# EAGLE design PCB_4 (EAGLE 9.6.2)
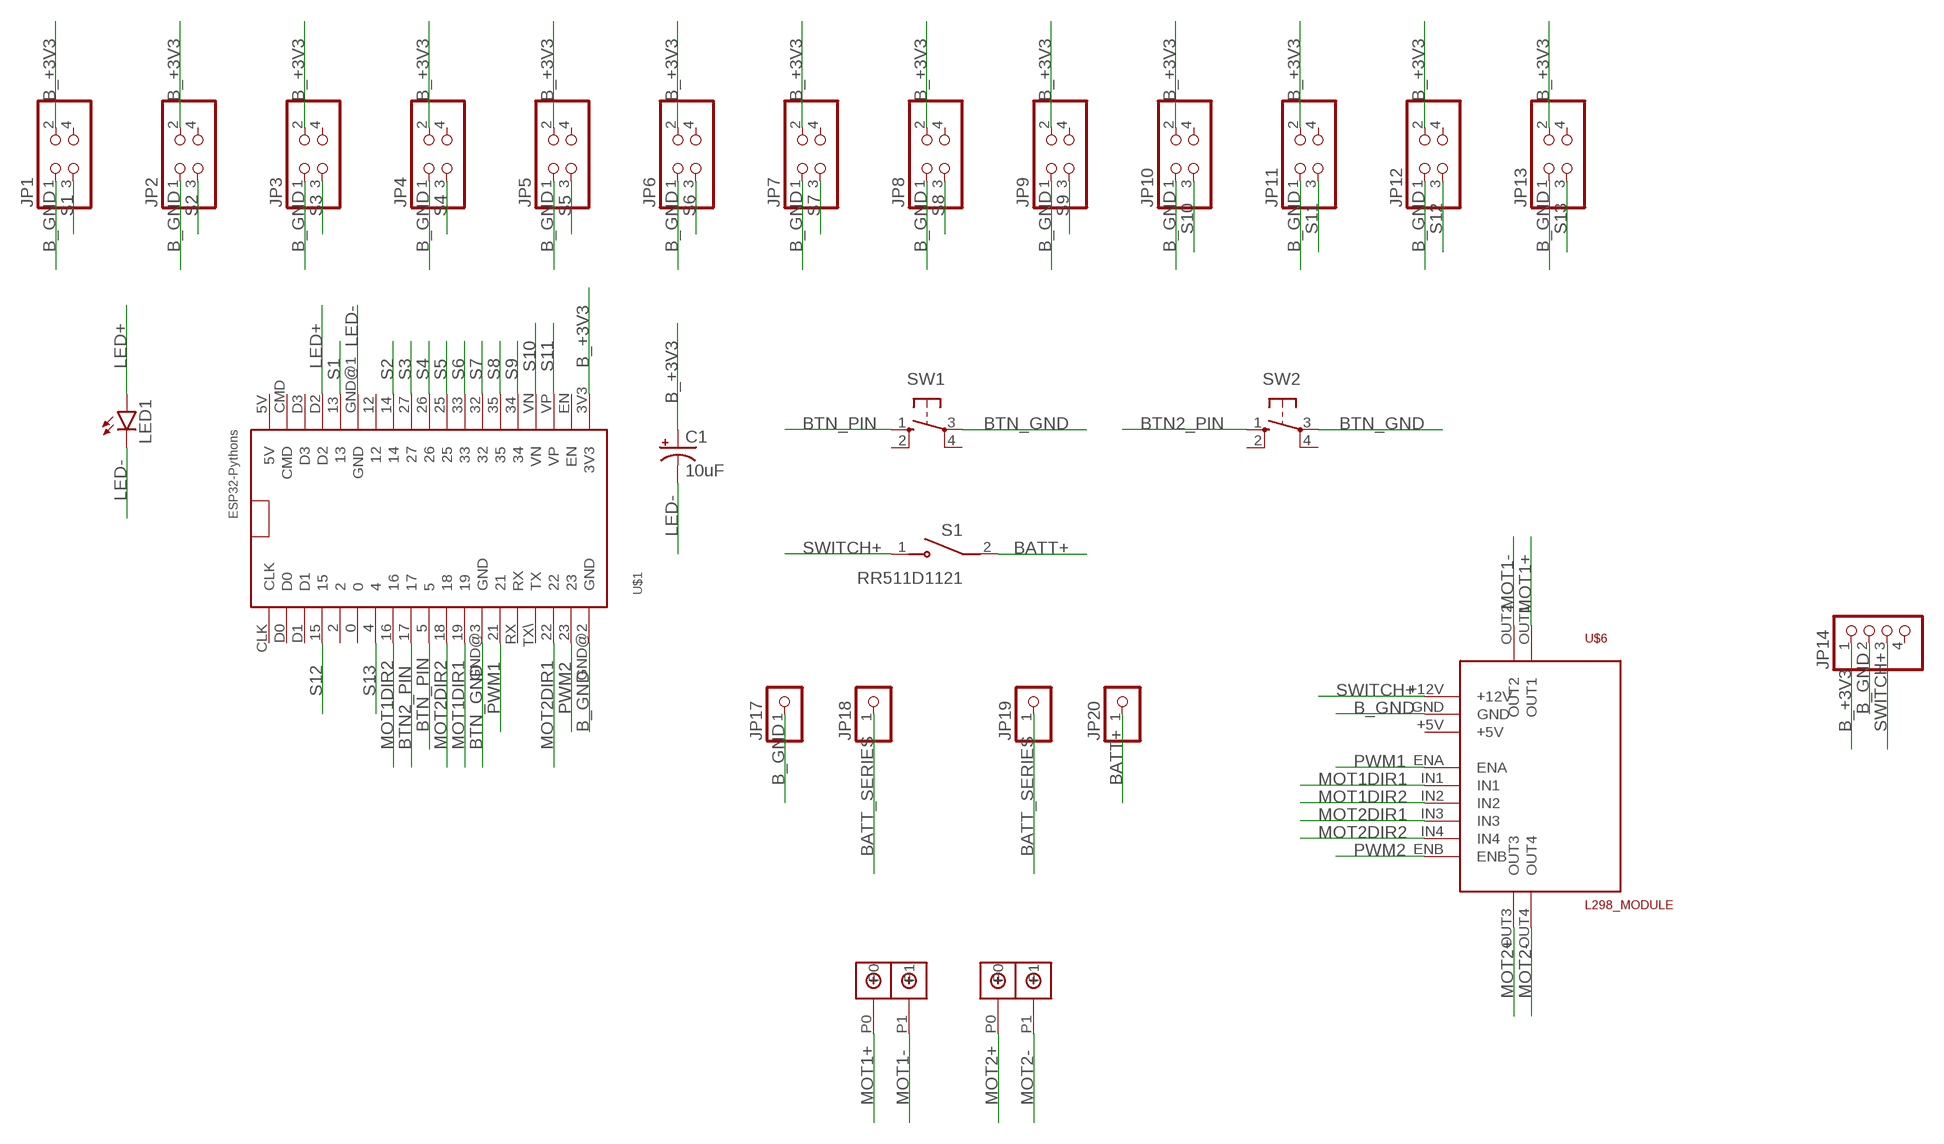
[diagram p0: schematic, sheet 1]

## Parts
C1  10uF  10UF-POLAR-RADIAL-2.5MM-25V-20%  [CPOL-RADIAL-2.5MM-5MM]
JP1  PINHD-2X2  [2X02]
JP2  PINHD-2X2  [2X02]
JP3  PINHD-2X2  [2X02]
JP4  PINHD-2X2  [2X02]
JP5  PINHD-2X2  [2X02]
JP6  PINHD-2X2  [2X02]
JP7  PINHD-2X2  [2X02]
JP8  PINHD-2X2  [2X02]
JP9  PINHD-2X2  [2X02]
JP10  PINHD-2X2  [2X02]
JP11  PINHD-2X2  [2X02]
JP12  PINHD-2X2  [2X02]
JP13  PINHD-2X2  [2X02]
JP14  PINHD-1X4  [1X04]
JP17  PINHD-1X1  [1X01]
JP18  PINHD-1X1  [1X01]
JP19  PINHD-1X1  [1X01]
JP20  PINHD-1X1  [1X01]
LED1  LED5MM  [LED5MM]
S1  RR511D1121  [E-SWITCH_RR511D1121]
SW1  10-XX  [B3F-10XX]
SW2  10-XX  [B3F-10XX]
U$1  ESP32DEVKITV1  [ESP32-DEVKITV1]
U$2  DBCONN-1X2  [DBCONN-1X2]
U$3  DBCONN-1X2  [DBCONN-1X2]
U$6  L298_MODULE  [L298_MODULE]

## Nets
B_+3V3: C1.1(+) JP1.2 JP2.2 JP3.2 JP4.2 JP5.2 JP6.2 JP7.2 JP8.2 JP9.2 JP10.2 JP11.2 JP12.2 JP13.2 JP14.1 U$1.3V3
B_GND: JP1.1 JP2.1 JP3.1 JP4.1 JP5.1 JP6.1 JP7.1 JP8.1 JP9.1 JP10.1 JP11.1 JP12.1 JP13.1 JP14.2 JP17.1 U$1.GND@2(GND) U$6.GND
BATT+: JP20.1 S1.2(COM)
BATT_SERIES: JP18.1 JP19.1
BTN2_PIN: SW2.1(S) U$1.17
BTN_GND: SW1.3(P) SW2.3(P) U$1.GND@3(GND)
BTN_PIN: SW1.1(S) U$1.5
LED+: LED1.A U$1.D2
LED-: C1.2(-) LED1.K(C) U$1.GND@1(GND)
MOT1+: U$2.P0 U$6.OUT1
MOT1-: U$2.P1 U$6.OUT2
MOT1DIR1: U$1.19 U$6.IN1
MOT1DIR2: U$1.16 U$6.IN2
MOT2+: U$3.P0 U$6.OUT3
MOT2-: U$3.P1 U$6.OUT4
MOT2DIR1: U$1.22 U$6.IN3
MOT2DIR2: U$1.18 U$6.IN4
PWM1: U$1.21 U$6.ENA
PWM2: U$1.23 U$6.ENB
S1: JP1.3 U$1.13
S2: JP2.3 U$1.14
S3: JP3.3 U$1.27
S4: JP4.3 U$1.26
S5: JP5.3 U$1.25
S6: JP6.3 U$1.33
S7: JP7.3 U$1.32
S8: JP8.3 U$1.35
S9: JP9.3 U$1.34
S10: JP10.3 U$1.VN
S11: JP11.3 U$1.VP
S12: JP12.3 U$1.15
S13: JP13.3 U$1.4
SWITCH+: JP14.3 S1.1(NO) U$6.+12V
Unconnected: JP1.4 JP2.4 JP3.4 JP4.4 JP5.4 JP6.4 JP7.4 JP8.4 JP9.4 JP10.4 JP11.4 JP12.4 JP13.4 JP14.4 SW1.2(S1) SW1.4(P1) SW2.2(S1) SW2.4(P1) U$1.0 U$1.2 U$1.5V U$1.12 U$1.CLK U$1.CMD U$1.D0 U$1.D1 U$1.D3 U$1.EN U$1.RX U$1.TX\(TX) U$6.+5V

## Library data of the parts
C1 = SparkFun-Capacitors:10UF-POLAR: 10.0µF polarized capacitors A capacitor is a passive two-terminal electrical component used to store electrical energy temporarily in an electric field.; PROD_ID: CAP-08440
JP1-JP13 = pinhead:PINHD-2X2: PIN HEADER
JP14 = pinhead:PINHD-1X4: PIN HEADER
JP17-JP20 = pinhead:PINHD-1X1: PIN HEADER
LED1 = led:LED: LED OSRAM: - CHIPLED LG R971, LG N971, LY N971, LG Q971, LY Q971, LO R971, LY R971 LH N974, LH R974 LS Q976, LO Q976, LY Q976 LO Q996 - Hyper CHIPLED LW Q18S LB Q993, LB Q99A, LB R99A - SideLED LS A670, LO A670, LY A670, LG A670, LP A670 LB A673, LV A673, LT A673, LW A673 LH A674 LY A675 LS A676, LA A676, LO A676, LY A676, LW A676 LS A679, LY A679, LG A679 - Hyper Micro SIDELED® LS Y876, LA Y876, LO Y876, LY Y876 LT Y87S - SmartLED LW L88C, LW L88S LB L89C, LB L89S, LG L890 LS L89K, LO L89K, LY L89K LS L896, LA L896, LO L896, LY L896 - TOPLED LS T670, LO T670, LY T670, LG T670, LP T670 LSG T670, LSP T670, LSY T670, LOP T670, LYG T670 LG T671, LOG T671, LSG T671 LB T673, LV T673, LT T673, LW T673 LH T674 LS T676, LA T676, LO T676, LY T676, LB T676, LH T676, LSB T676, LW T676 LB T67C, LV T67C, LT T67C, LS T67K, LO T67K, LY T67K, LW E67C LS E67B, LA E67B, LO E67B, LY E67B, LB E67C, LV E67C, LT E67C LW T67C LS T679, LY T679, LG T679 LS T770, LO T770, LY T770, LG T770, LP T770 LB T773, LV T773, LT T773, LW T773 LH T774 LS E675, LA E675, LY E675, LS T675 LS T776, LA T776, LO T776, LY T776, LB T776 LHGB T686 LT T68C, LB T68C - Hyper Mini TOPLED® LB M676 - Mini TOPLED Santana® LG M470 LS M47K, LO M47K, LY M47K Source: http://www.osram.convergy.de LUXEON: - LUMILED® LXK2-PW12-R00, LXK2-PW12-S00, LXK2-PW14-U00, LXK2-PW14-V00 LXK2-PM12-R00, LXK2-PM12-S00, LXK2-PM14-U00 LXK2-PE12-Q00, LXK2-PE12-R00, LXK2-PE12-S00, LXK2-PE14-T00, LXK2-PE14-U00 LXK2-PB12-K00, LXK2-PB12-L00, LXK2-PB12-M00, LXK2-PB14-N00, LXK2-PB14-P00, LXK2-PB14-Q00 LXK2-PR12-L00, LXK2-PR12-M00, LXK2-PR14-Q00, LXK2-PR14-R00 LXK2-PD12-Q00, LXK2-PD12-R00, LXK2-PD12-S00 LXK2-PH12-R00, LXK2-PH12-S00 LXK2-PL12-P00, LXK2-PL12-Q00, LXK2-PL12-R00 Source: www.luxeon.com KINGBRIGHT: KA-3528ASYC Source: www.kingbright.com
S1 = RR511D1121:RR511D1121: Check availability <https://pricing.snapeda.com/parts/RR511D1121/E-Switch/view-part?ref=eda>; AVAILABILITY: In Stock; CHECK_PRICES: https://www.snapeda.com/parts/RR511D1121/E-Switch/view-part/?ref=eda; DESCRIPTION: Rocker Switch, RR5 Series, SPST,OFF-ON,Blk Rocker,I/O Legend, 20A, 125VAC, | E-Switch RR511D1121; MF: E-Switch; MP: RR511D1121; PACKAGE: None; PRICE: None; PURCHASE-URL: https://www.snapeda.com/api/url_track_click_mouser/?unipart_id=351624&manufacturer=E-Switch&part_name=RR511D1121&search_term=None; SNAPEDA_LINK: https://www.snapeda.com/parts/RR511D1121/E-Switch/view-part/?ref=snap
SW1 SW2 = buttons:10-XX: OMRON SWITCH
U$1 = ESP32-DEVKITV1:ESP32DEVKITV1
U$2 U$3 = Terminal Block Connector:DBCONN-1X2
U$6 = L298_Module:L298_MODULE

## Board
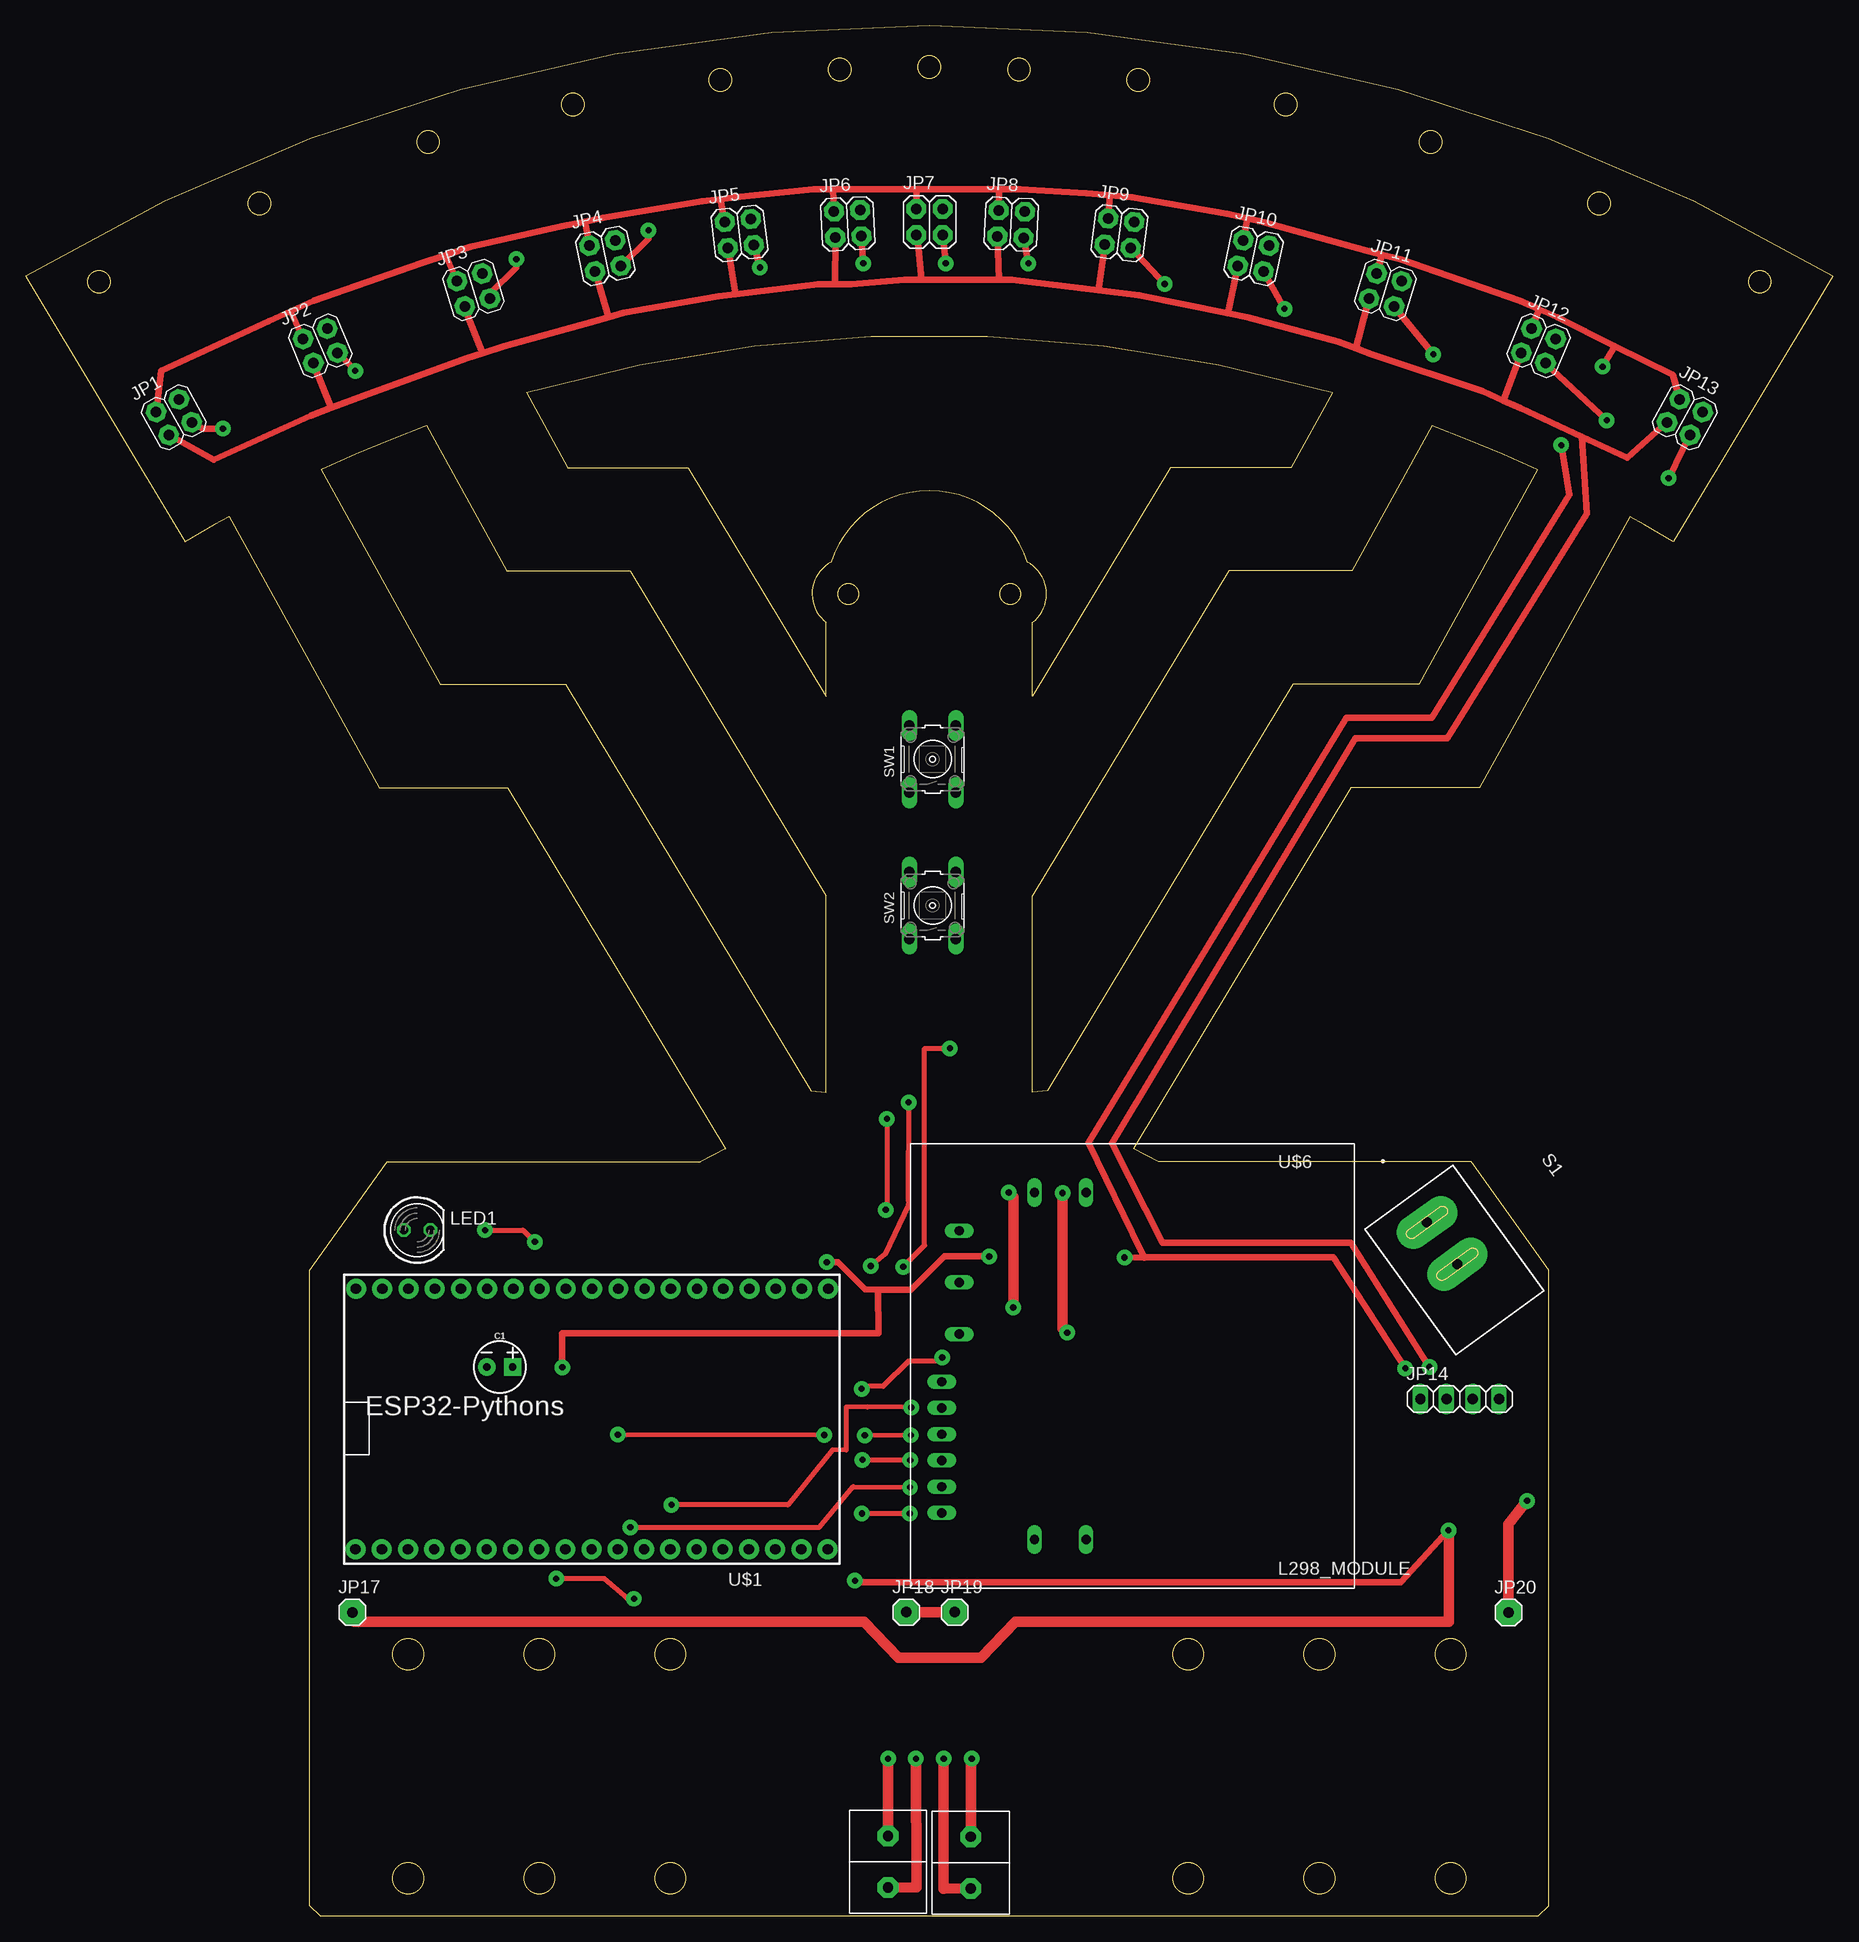
[diagram p1: board, top side]
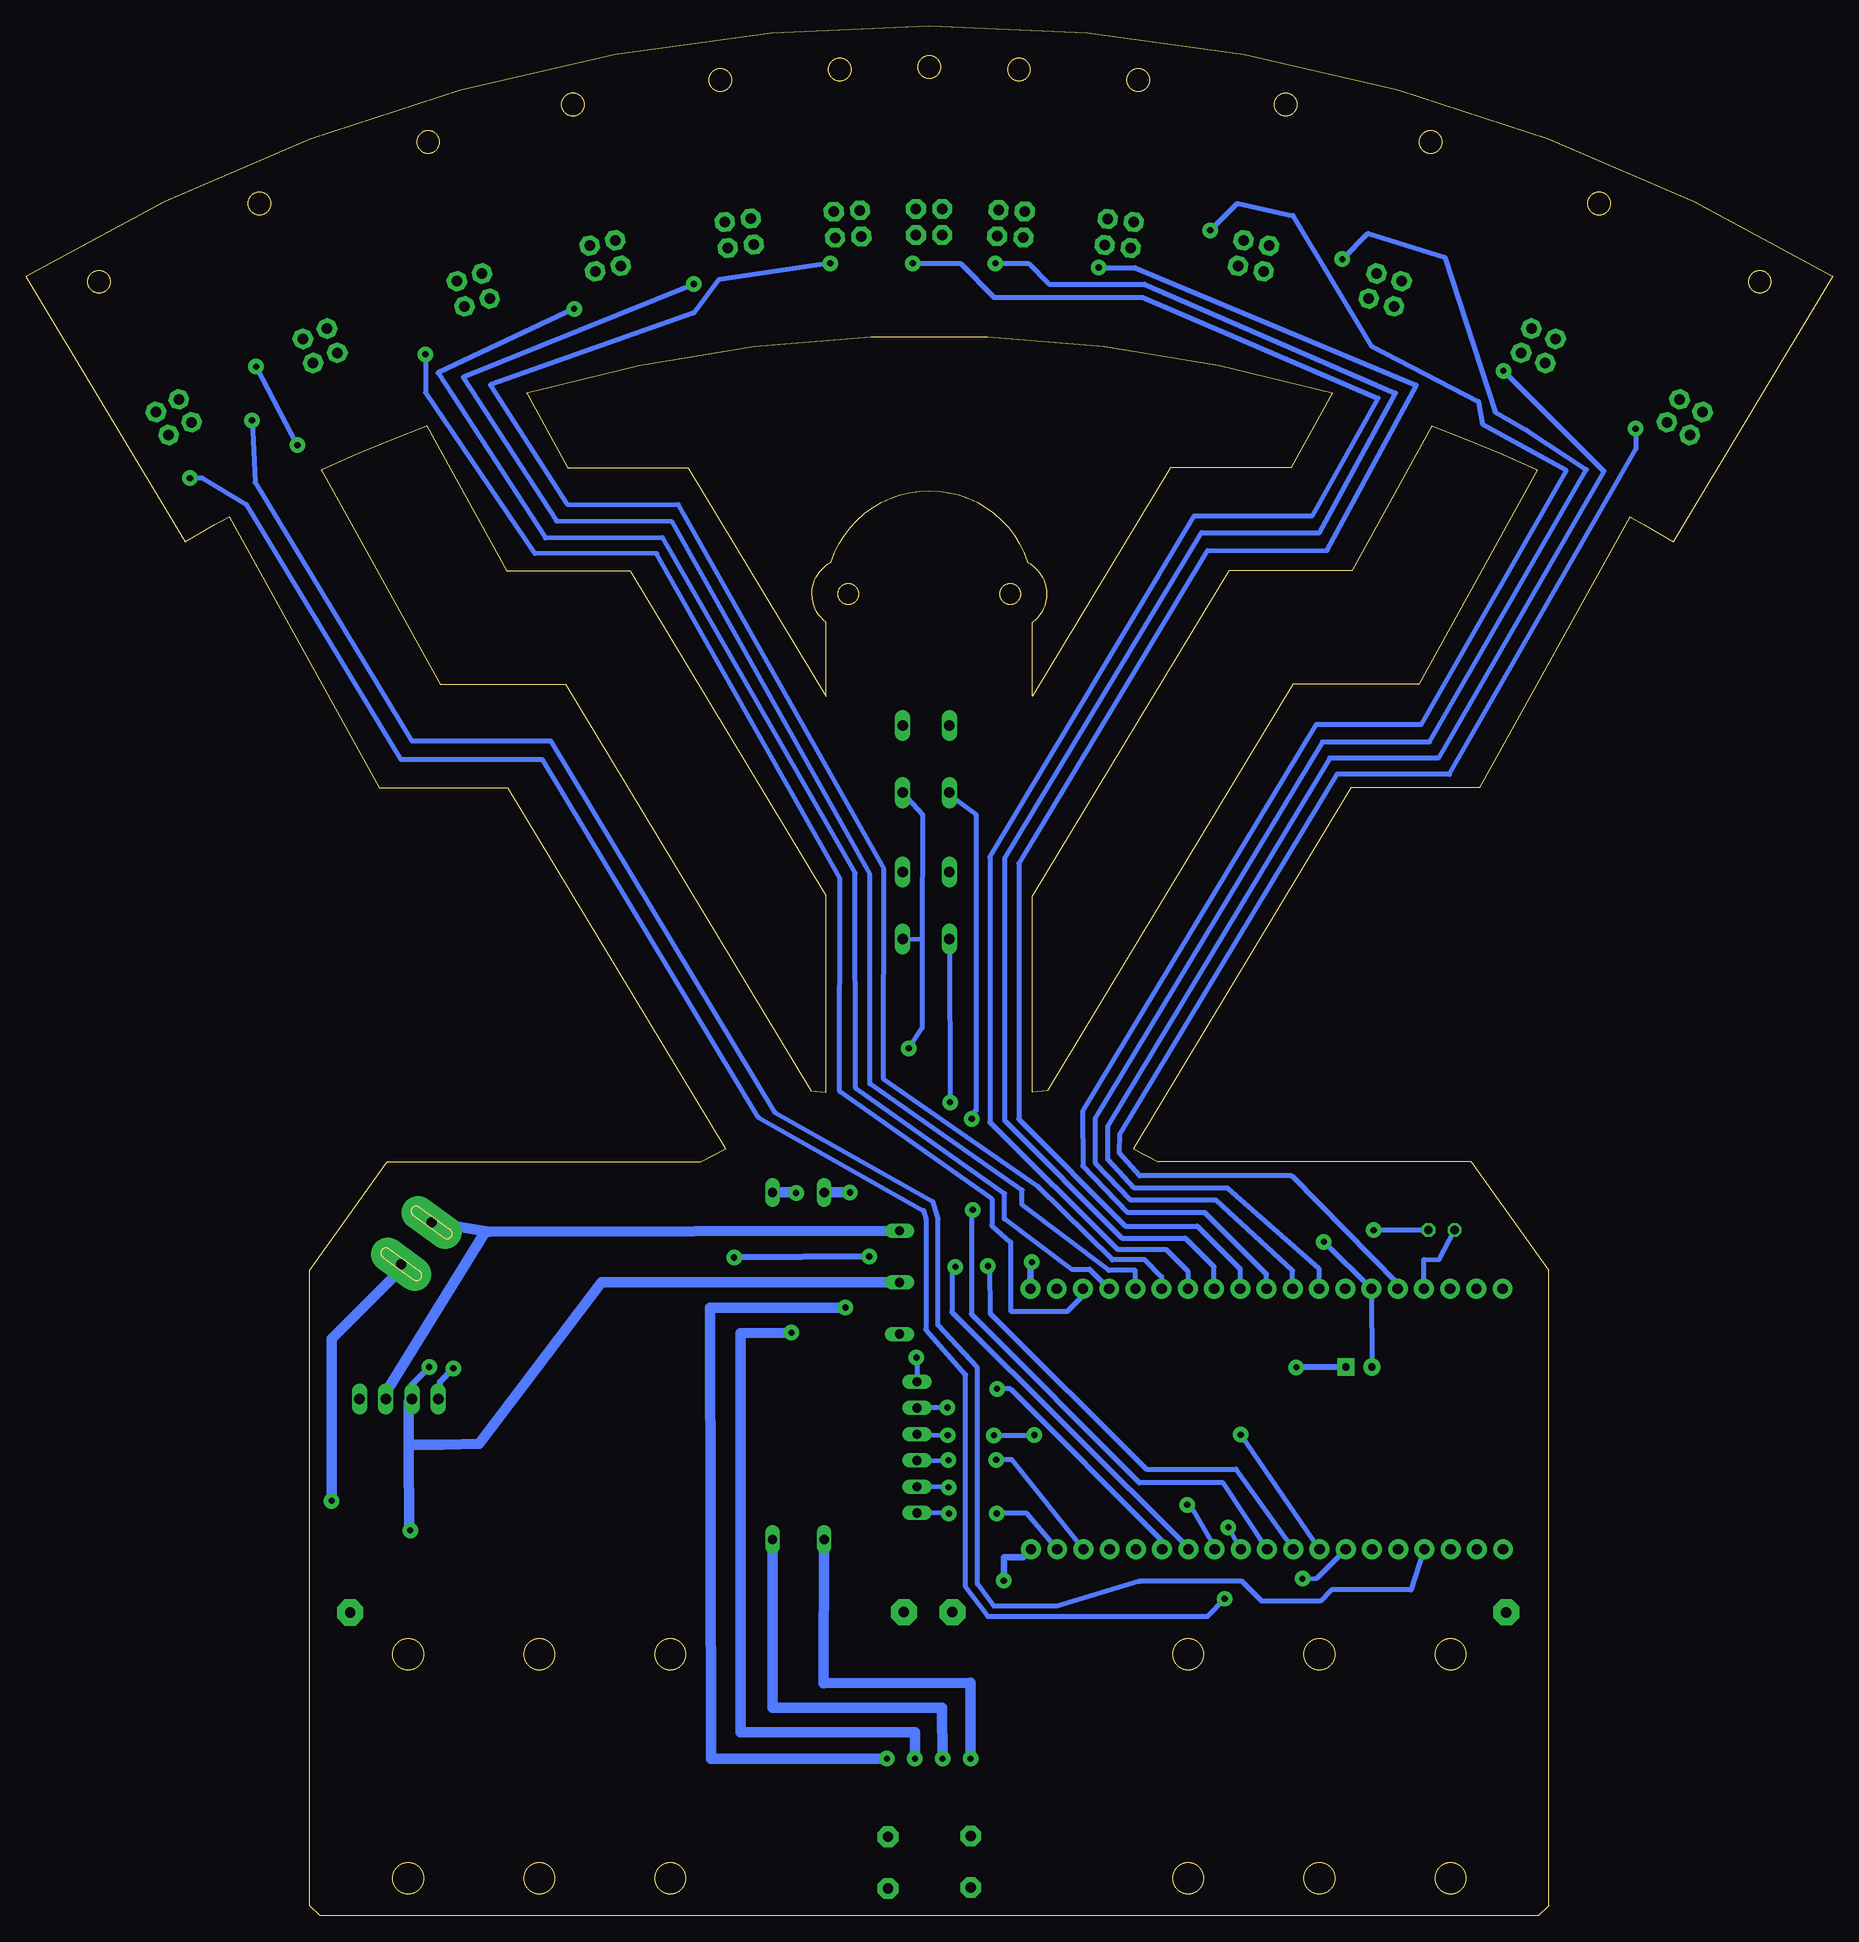
[diagram p2: board, bottom side, seen from below]

Size 175 x 183 mm. Coordinates in mm from the lower left corner, seen from the top.
Outline: 155.33,135.47 155.33,135.47
Outline: 155.33,135.47 140.79,109.23 128.35,109.23 107.25,74.28 109.67,73 140,73 147.5,62.5 147.5,1 146.5,0 28.5,0 27.5,1 27.5,62.5 35,73 65.33,73 67.75,74.28 46.65,109.23 34.21,109.23 19.67,135.47 arc2 15.44,133.03
Outline: 155.33,135.47 arc-2 159.56,133.03 175,158.75 arc62 0,158.75 15.44,133.03
Outline: 15.44,133.03 15.44,133.03
Outline: 97.5,118.11 97.5,125.24 arc114 97.01,131.08 arc144 77.99,131.08 arc114 77.5,125.24 77.5,118.11 64.15,140.23 52.48,140.23 48.48,147.45 arc-32 126.52,147.45 122.52,140.23 110.85,140.23 97.5,118.11
Outline: 28.59,140 40.1,119.23 52.3,119.23 76.04,79.89 77.5,79.76 77.5,98.76 58.51,130.23 46.58,130.23 38.81,144.26 arc5 28.59,140
Outline: 146.41,140 arc5 136.19,144.26 128.42,130.23 116.49,130.23 97.5,98.76 97.5,79.76 98.96,79.89 122.7,119.23 134.9,119.23 146.41,140
Outline: circle at 125.28,25.35 radius 1.5
Outline: circle at 137.97,25.35 radius 1.5
Outline: circle at 37.02,25.35 radius 1.5
Outline: circle at 49.73,25.35 radius 1.5
Outline: circle at 62.42,25.35 radius 1.5
Outline: circle at 112.58,25.35 radius 1.5
Outline: circle at 125.28,3.65 radius 1.5
Outline: circle at 37.02,3.65 radius 1.5
Outline: circle at 49.73,3.65 radius 1.5
Outline: circle at 62.42,3.65 radius 1.5
Outline: circle at 95.35,128 radius 1
Outline: circle at 167.92,158.22 radius 1.09
Outline: circle at 152.36,165.8 radius 1.09
Outline: circle at 136.03,171.75 radius 1.09
Outline: circle at 122.01,175.37 radius 1.09
Outline: circle at 107.73,177.76 radius 1.09
Outline: circle at 96.19,178.77 radius 1.09
Outline: circle at 87.5,179 radius 1.09
Outline: circle at 78.81,178.77 radius 1.09
Outline: circle at 67.27,177.76 radius 1.09
Copper layers (1*16): Top 0.035mm / dielectric 1.5mm / Bottom 0.035mm
Design rules "default *": minimum track width 0.5mm, minimum drill 0.35mm, track to track 0.5mm, track to pad 0.5mm, pad to pad 0.5mm, via to via 0.5mm, smd to smd 6mil, copper to edge 40mil, drill to drill 6mil, minimum pad ring 10mil, minimum via ring 8mil, stop-mask expansion 4mil, vias tented up to drill 0mil, thermal gap 10mil

### Footprints (pad centres in the part's own frame; a part is rotated, then mirrored left to right if it is on the bottom)
CPOL-RADIAL-2.5MM-5MM = drill 0.7 pad 1.651 square: 1 1.25,0 | drill 0.7 pad 1.651: 2 -1.25,0
2X02 = drill 1.016 pad 1.905 octagon: 1 -1.27,-1.27; 2 -1.27,1.27; 3 1.27,-1.27; 4 1.27,1.27
1X04 = drill 1.016 long: 1 -3.81,0; 2 -1.27,0; 3 1.27,0; 4 3.81,0
1X01 = drill 1.016 pad 2.54 octagon: 1 0,0
LED5MM = drill 0.813 octagon: A -1.27,0; K 1.27,0
E-SWITCH_RR511D1121 = drill 0.98 pad 3.26 long: 1 -5,0; 2 0,0
B3F-10XX = drill 1.016 long: 1 -3.251,2.261; 2 3.251,2.261; 3 -3.251,-2.261; 4 3.251,-2.261
ESP32-DEVKITV1 = drill 1 pad 1.93: 0 8.93,12.962; 2 11.47,12.962; 3V3 -24.14,-12.27; 4 6.39,12.962; 5 -1.23,12.962; 5V 21.58,-12.27; 12 6.34,-12.27; 13 11.42,-12.27; 14 3.8,-12.27; 15 14.01,12.962; 16 3.85,12.962; 17 1.31,12.962; 18 -3.77,12.962; 19 -6.31,12.962; 21 -11.39,12.962; 22 -19.01,12.962; 23 -21.55,12.962; 25 -3.82,-12.27; 26 -1.28,-12.27; 27 1.26,-12.27; 32 -8.9,-12.27; 33 -6.36,-12.27; 34 -13.98,-12.27; 35 -11.44,-12.27; CLK 21.63,12.962; CMD 19.04,-12.27; D0 19.09,12.962; D1 16.55,12.962; D2 13.96,-12.27; D3 16.5,-12.27; EN -21.6,-12.27; GND@1 8.88,-12.27; GND@2 -24.09,12.962; GND@3 -8.85,12.962; RX -13.93,12.962; TX\ -16.47,12.962; VN -16.52,-12.27; VP -19.06,-12.27
DBCONN-1X2 = drill 1 pad 2 octagon: P0 -2.54,0; P1 2.46,0
L298_MODULE = drill 0.9 pad 1.422 long: +5V 4.7,24.58; +12V 4.7,34.58; ENA 3.01,19.97; ENB 3.01,7.27; GND 4.7,29.58; IN1 3.01,17.43; IN2 3.01,14.89; IN3 3.01,12.35; IN4 3.01,9.81; OUT1 16.99,38.3; OUT2 11.99,38.3; OUT3 11.99,4.7; OUT4 16.99,4.7

### Placement (x,y rotation side)
C1  45.9,53.15 0 top
JP1  14.34,145.11 29 top
JP2  28.52,152.02 23 top
JP3  43.35,157.43 17 top
JP4  56.1,160.73 12 top
JP5  69.11,162.89 7 top
JP6  79.6,163.83 3 top
JP7  87.52,164.01 0 top
JP8  95.42,163.8 357 top
JP9  105.91,162.92 353 top
JP10  118.89,160.73 348 top
JP11  131.67,157.43 343 top
JP12  146.5,152.02 337 top
JP13  160.67,145.11 331 top
JP14  138.87,50.04 0 top
JP17  31.63,29.4 0 top
JP18  85.27,29.41 0 top
JP19  89.96,29.41 0 top
JP20  143.59,29.38 0 top
LED1  37.9,66.4 0 top
S1  138.64,63.1 306 top
SW1  87.82,112 90 top
SW2  87.82,97.83 90 top
U$1  53.56,48.46 180 top
U$2  91.5,5.2 90 top
U$3  83.5,5.2 270 top
U$6  85.69,31.75 0 top

### Tracks (layer width: path | path; a pad name or v marks a point on that pad's centre or on a via)
B_+3V3  (via drill 0.6 pad 1.5)
  Top 0.61: JP1.2 13.1,149.6 23.5,154.4 25.65,155.38 | 78.16,167.2 86.24,167.2 | 86.24,167.2 94.26,167.2 | 153.9,152 148.3,154.8 146.6,155.56 | 153.9,152 159.5,149.2 JP13.2 | v77.57,63.3 78.64,63.3 81.29,60.65 82.55,60.64 | 82.55,60.64 85.72,60.62 88.98,63.88 v93.31,63.85 | 108.32,63.76 126.65,63.76 v133.6,53.02 | v106.4,63.76 108.33,63.74 108.32,63.76 | v148.7,142.4 149.5,137.61 136.16,116.03 127.9,116.03 102.91,74.87 108,64.42 108.32,63.76 | v152.7,150 153.9,152 | 146.6,155.56 144.7,156.4 133.1,160.4 131.34,160.84 | 131.34,160.84 129.9,161.2 119.9,164 118.3,164.36 | JP11.2 131.34,160.84 | JP12.2 146.6,155.56 | 118.3,164.36 116.3,164.8 107.1,166.4 105.02,166.59 | JP10.2 118.3,164.36 | 105.02,166.59 102.7,166.8 96.3,167.2 94.26,167.2 | JP9.2 105.02,166.59 | JP8.2 94.26,167.2 | JP7.2 86.24,167.2 | 78.16,167.2 76.3,167.2 68.7,166.4 67.29,166.22 | JP6.2 78.16,167.2 | 67.29,166.22 65.5,166 55.9,164.4 54.15,164.05 | JP5.2 67.29,166.22 | 25.65,155.38 27.9,156.4 38.3,160 40.67,160.79 | 40.67,160.79 43.1,161.6 51.9,163.6 54.15,164.05 | JP4.2 54.15,164.05 | JP3.2 40.67,160.79 | JP2.2 25.65,155.38 | 82.55,60.64 82.58,56.4 51.96,56.4 v51.96,53.11
  Bottom 0.5: v148.7,142.4 v152.7,150 | 77.7,63.17 v77.57,63.3 | 106.21,63.76 v106.4,63.76
  Bottom 0.61: U$1.3V3 77.7,63.17 | JP14.1 135.06,50.95 134.88,51.74 v133.6,53.02 | v93.31,63.85 106.21,63.76 | v51.96,53.11 C1.1
B_GND  (via drill 0.6 pad 1.5)
  Top 0.61: JP3.1 42.51,155.67 44.25,151.32 | 68.75,157.01 76.7,158 78.35,158 | JP7.1 86.34,162.5 86.72,158.4 | 86.72,158.4 94.24,158.4 | 150.71,143.22 144.79,145.96 143.07,146.72 | 150.71,143.22 155.1,141.2 JP13.1 | 150.71,143.22 151.19,135.76 137.68,114 128.76,114 105.18,74.8 110.09,65.18 128.32,65.18 v135.94,53.14 | JP1.1 18.21,140.98 27.58,145.24 29.58,146 | v80.29,32.46 80.46,32.29 133.14,32.29 v137.78,37.33 v137.78,37.34 | 29.58,146 32.7,147.2 42.7,150.8 44.25,151.32 | 44.25,151.32 46.3,152 55.1,154.4 56.46,154.79 | 56.46,154.79 57.9,155.2 67.1,156.8 68.75,157.01 | 78.35,158 79.9,158 85.1,158.4 86.72,158.4 | 94.24,158.4 95.5,158.4 102.3,157.6 103.87,157.4 103.87,157.41 | 103.87,157.41 107.78,156.9 116.4,155.18 | 116.4,155.18 118.3,154.8 127.1,152.4 128.8,151.76 | 128.8,151.76 130.3,151.2 141.1,147.6 143.07,146.72 | 143.07,146.72 JP12.1 | 128.8,151.76 JP11.1 | 116.4,155.18 JP10.1 | 103.87,157.41 JP9.1 | 94.24,158.4 JP8.1 | 78.35,158 JP6.1 | 68.75,157.01 JP5.1 | 56.46,154.79 JP4.1 | JP2.1 29.58,146
  Top 1.016: JP17.1 31.82,28.48 81.19,28.48 84.5,25 92.5,25 95.82,28.49 137.8,28.49 137.83,37.29 v137.78,37.34
  Bottom 0.61: U$1.GND@2 78.4,34.75 80.29,34.75 v80.29,32.46 | JP14.2 137.6,51.48 v135.94,53.14
  Bottom 1.016: JP14.2 137.93,49.71 137.91,45.61 | 137.91,45.61 137.88,37.34 v137.78,37.34 | 137.91,45.61 134.65,45.6 131.11,45.7 119.24,61.33 U$6.GND
BATT+  (via drill 0.6 pad 1.5)
  Top 1.016: v145.39,40.19 143.59,37.91 JP20.1
  Bottom 1.016: S1.2 138.64,62.61 145.39,55.86 v145.39,40.19
BATT_SERIES
  Top 1.016: JP19.1 JP18.1
BTN2_PIN  (via drill 0.6 pad 1.5)
  Top 0.5: v85.49,78.77 85.46,69.44 85.46,68.86 83.21,64.08 v81.83,62.93
  Bottom 0.5: SW2.1 v85.49,78.77 | v81.83,62.93 81.69,62.79 81.6,58.35 66.48,43.27 57.8,43.27 U$1.17
BTN_GND  (via drill 0.6 pad 1.5)
  Top 0.5: v89.49,84 87.05,84 87.05,64.92 v84.98,62.84
  Bottom 0.5: U$1.GND@3 62.41,35.63 85.33,58.47 85.33,62.49 v84.98,62.84 | SW1.3 88.14,106.6 88.19,94.63 | 88.19,94.63 88.19,85.97 v89.49,84 | SW2.3 88.19,94.63
BTN_PIN  (via drill 0.6 pad 1.5)
  Top 0.5: v83.39,77.18 83.39,68.47 v83.29,68.37
  Bottom 0.5: U$1.5 59.04,41.94 67.15,41.94 83.42,58.26 83.42,68.37 v83.29,68.37 | SW1.1 85.53,108.55 82.99,106.64 82.97,77.96 83.03,77.96 83.39,77.6 v83.39,77.18
LED+
  Bottom 0.5: LED1.A 38.13,63.53 39.6,63.56 U$1.D2
LED-  (via drill 0.6 pad 1.5)
  Top 0.5: v44.47,66.4 48.16,66.4 v49.29,65.27
  Bottom 0.5: LED1.K v44.47,66.4 | v49.29,65.27 U$1.GND@1 C1.2
MOT1+  (via drill 0.6 pad 1.5)
  Top 1.016: v100.4,70 100.4,56.92 v100.85,56.47 | U$2.P0 88.86,2.63 v88.89,15.22
  Bottom 1.016: v100.85,56.47 105.8,56.43 105.8,17.77 88.89,17.77 v88.89,15.22 | U$6.OUT1 100.45,70.05 v100.4,70
MOT1-  (via drill 0.6 pad 1.5)
  Top 1.016: U$2.P1 91.53,7.66 91.52,15.2 v91.61,15.22 | v95.19,70.05 95.67,69.57 95.65,58.93 v95.62,58.9
  Bottom 1.016: v95.62,58.9 108.72,58.9 108.62,15.2 v91.61,15.22 | v95.19,70.05 U$6.OUT2
MOT1DIR1  (via drill 0.6 pad 1.5)
  Top 0.5: v62.53,39.81 62.55,39.83 73.8,39.8 78.12,45.12 79.44,45.09 79.45,49.26 81.5,49.28 v85.75,49.23
  Bottom 0.5: v62.53,39.81 62.12,39.59 59.87,35.77 U$1.19 | U$6.IN1 85.77,49.18 v85.75,49.23
MOT1DIR2  (via drill 0.6 pad 1.5)
  Top 0.5: v57.34,46.59 57.36,46.57 v77.32,46.56 | v81.24,46.53 85.66,46.48 v85.72,46.54
  Bottom 0.5: U$1.16 v57.34,46.59 | v77.32,46.56 81.21,46.56 v81.24,46.53 | U$6.IN2 88.69,46.63 v85.72,46.54
MOT2+  (via drill 0.6 pad 1.5)
  Top 1.016: U$3.P0 v83.51,15.22
  Bottom 1.016: U$6.OUT3 97.75,22.54 83.49,22.58 v83.51,15.22
MOT2-  (via drill 0.6 pad 1.5)
  Top 1.016: U$3.P1 86.25,2.76 v86.21,15.22
  Bottom 1.016: U$6.OUT4 102.66,20.14 86.26,20.14 v86.21,15.22
MOT2DIR1  (via drill 0.6 pad 1.5)
  Top 0.5: v85.65,44.13 81.04,44.14 v81.02,44.16
  Bottom 0.5: U$1.22 79.49,44.16 v81.02,44.16 | v85.65,44.13 85.68,44.1 88.67,44.07 U$6.IN3
MOT2DIR2  (via drill 0.6 pad 1.5)
  Top 0.5: v58.54,37.62 76.87,37.65 80.13,41.56 v85.63,41.5
  Bottom 0.5: U$1.18 v58.54,37.62 | v85.63,41.5 U$6.IN4
PWM1  (via drill 0.6 pad 1.5)
  Top 0.5: v80.94,51.03 81.17,51.26 83.03,51.26 85.48,53.71 88.4,53.71 v88.75,54.06
  Bottom 0.5: U$1.21 64.95,36.34 79.65,51.03 v80.94,51.03 | U$6.ENA 88.7,54.06 v88.75,54.06
PWM2  (via drill 0.6 pad 1.5)
  Top 0.5: v80.97,38.97 v85.6,38.97
  Bottom 0.5: U$1.23 78.06,38.97 v80.97,38.97 | v85.6,38.97 U$6.ENB
S1  (via drill 0.6 pad 1.5)
  Top 0.61: v19.1,144 17.13,144 JP1.3
  Bottom 0.5: v19.1,144 19.1,141.98 37.13,110.54 48.04,110.54 69.05,75.72 69.1,73.88 67.12,71.65 52.4,71.65 42.14,61.2 U$1.13
S2  (via drill 0.6 pad 1.5)
  Top 0.61: v31.9,149.6 31.91,149.61 30.91,150.61 JP2.3
  Bottom 0.5: v31.9,149.6 22.18,139.88 38.2,112.11 48.72,112.11 70.22,76.49 70.22,73.26 67.61,70.47 58.59,70.47 49.79,62.69 49.81,60.79 U$1.14
S3  (via drill 0.6 pad 1.5)
  Top 0.61: v47.5,160.4 47.5,159.6 44.94,157.03 JP3.3
  Bottom 0.5: v47.5,160.4 45,162.9 37.56,160.57 32.7,145.6 29.68,143.86 23.87,140.03 39.05,113.66 49.45,113.66 71.4,77.29 71.41,72.88 67.99,69.31 59.75,69.31 52.32,62.48 U$1.27
S4  (via drill 0.6 pad 1.5)
  Top 0.61: v60.3,163.2 60.3,162.4 57.65,159.75 JP4.3
  Bottom 0.5: v60.3,163.2 57.68,165.82 52.27,164.62 44.7,152 34.32,146.62 33.93,144.43 25.81,139.95 39.88,115.35 50.05,115.35 72.66,77.89 72.64,72.61 68.27,68.1 60.8,68.1 54.84,62.13 U$1.26
S5  (via drill 0.6 pad 1.5)
  Top 0.61: JP5.3 v71.1,159.6
  Bottom 0.5: v71.1,159.6 67.58,159.6 40.33,148.22 48.99,132.21 60.54,132.2 78.84,101.88 78.84,77.15 68.49,66.79 61.55,66.79 57.38,62.62 U$1.25
S6  (via drill 0.6 pad 1.5)
  Top 0.61: JP6.3 v81.1,160
  Bottom 0.5: v81.1,160 77.9,160 75.9,158 66.66,158 42.35,147.45 49.72,133.94 61.14,133.93 80.2,102.36 80.2,77.02 68.83,65.62 62.7,65.62 59.92,62.84 U$1.33
S7  (via drill 0.6 pad 1.5)
  Top 0.61: JP7.3 v89.1,160
  Bottom 0.5: v89.1,160 84.5,160 81.22,156.72 66.84,156.72 44.04,146.95 50.46,135.54 61.86,135.54 81.64,102.53 81.64,76.84 69.28,64.54 64.58,64.54 62.46,62.42 U$1.32
S8  (via drill 0.6 pad 1.5)
  Top 0.61: JP8.3 v97.1,160
  Bottom 0.5: v97.1,160 107.9,158.4 110.3,155.2 130.03,148.24 122.58,136.68 111.83,136.64 91.89,101.34 91.92,81.03 77.02,70.64 69.78,63.52 66.6,63.52 65,61.91 U$1.35
S9  (via drill 0.6 pad 1.5)
  Top 0.61: JP9.3 v110.3,158
  Bottom 0.5: v110.3,158 132.64,148.99 123.61,135.06 112.46,135.03 93.26,100.8 93.26,80.56 78.52,70.27 78.52,68.88 70.11,62.5 67.54,62.5 U$1.34
S10  (via drill 0.6 pad 1.5)
  Top 0.61: JP10.3 v121.9,155.6
  Bottom 0.5: v121.9,155.6 135.08,149.4 124.68,133.43 113.38,133.47 94.68,100.96 94.64,80.16 80.22,69.94 80.23,67.48 73.72,62.62 71.97,62.62 U$1.VN
S11  (via drill 0.6 pad 1.5)
  Top 0.61: JP11.3 v136.3,151.2
  Bottom 0.5: v136.3,151.2 136.3,147.48 125.72,131.92 113.9,131.9 96.16,100.45 96.19,79.82 81.44,69.43 81.44,66.85 79.62,65.24 79.62,58.55 74.12,58.55 72.62,60.05 U$1.VP
S12  (via drill 0.6 pad 1.5)
  Top 0.61: JP12.3 v153.1,144.8
  Bottom 0.5: v153.1,144.8 152.8,138.8 137.62,113.78 124.17,113.78 102.47,77.83 87.17,69.19 86.68,67.42 86.68,57.24 82.85,53.11 82.85,32.15 81.24,30 75.14,30 67.14,32.4 57.22,32.4 55.31,30.49 49.63,30.49 48.56,31.56 40.84,31.56 U$1.15
S13  (via drill 0.6 pad 1.5)
  Top 0.5: v58.9,30.71 58.28,30.71 56,32.66 v51.36,32.66
  Top 0.61: JP13.3 v159.1,139.2
  Bottom 0.5: v51.36,32.66 49.98,32.69 U$1.4 | v58.9,30.71 58.9,30.64 60.54,29 81.83,29 83.98,31.86 83.98,52.4 87.82,56.77 87.82,67.47 88.06,68.3 104.07,77.34 124.95,111.94 138.67,111.96 153.63,136.65 157.88,139.2 v159.1,139.2
SWITCH+
  Bottom 1.016: U$6.+12V 130.09,66.24 130.45,66.3 | 130.45,66.3 S1.1 | JP14.3 140.14,50.68 130.45,66.3